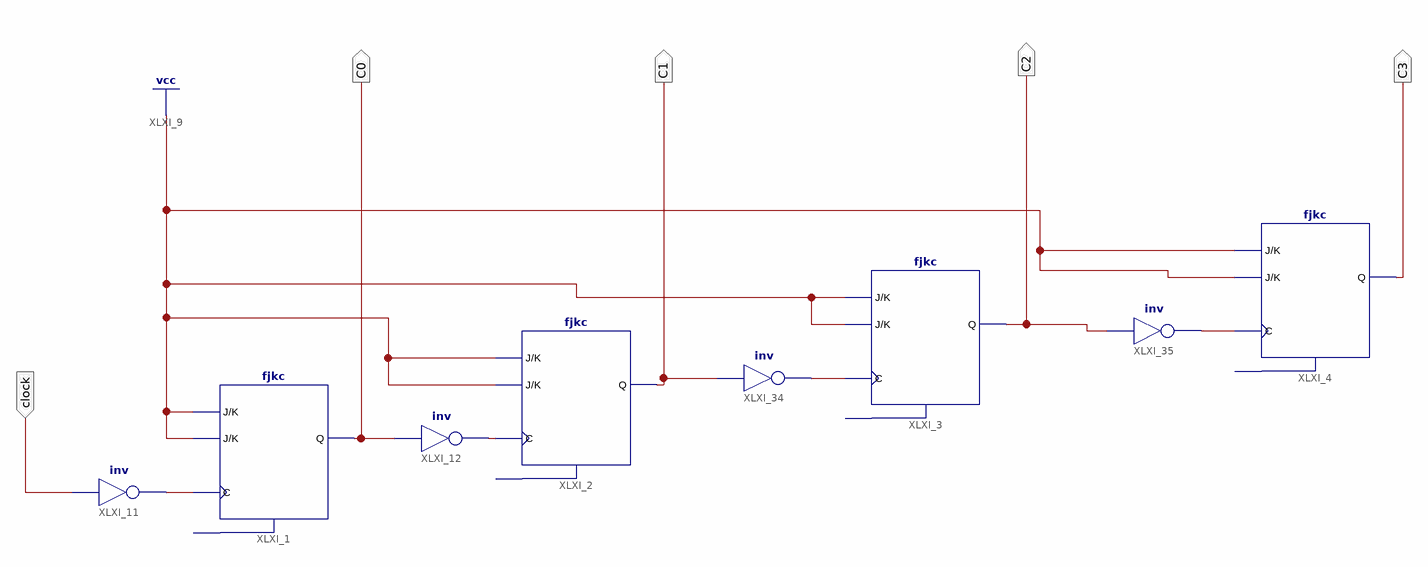
[diagram p0: schematic sheet 1]
// Xilinx ISE schematic SchematicAssincCount.sch (spartan3) as structural Verilog: 8 symbols, 5 ports
module SchematicAssincCount (
  input  clock,
  output C1,
  output C2,
  output C3,
  output C0
);

  wire XLXN_19, XLXN_20, XLXN_95, XLXN_96;

  fjkc XLXI_1 (.C(XLXN_19), .J(1'b1), .K(1'b1), .Q(C0));  // open: CLR
  not XLXI_11 (XLXN_19, clock);
  fjkc XLXI_2 (.C(XLXN_20), .J(1'b1), .K(1'b1), .Q(C1));  // open: CLR
  not XLXI_12 (XLXN_20, C0);
  fjkc XLXI_3 (.C(XLXN_95), .J(1'b1), .K(1'b1), .Q(C2));  // open: CLR
  fjkc XLXI_4 (.C(XLXN_96), .J(1'b1), .K(1'b1), .Q(C3));  // open: CLR
  not XLXI_34 (XLXN_95, C1);
  not XLXI_35 (XLXN_96, C2);
endmodule
